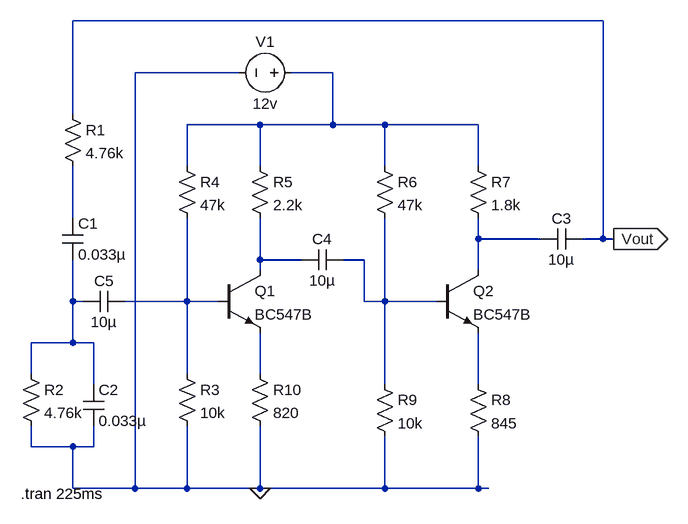
[diagram p0: schematic weinBridge.asc]
weinBridge.asc, the LTspice schematic file:
Version 4
SHEET 1 880 680
WIRE 672 -160 -144 -160
WIRE 112 -80 -48 -80
WIRE 256 -80 192 -80
WIRE -144 -16 -144 -160
WIRE 144 0 32 0
WIRE 256 0 256 -80
WIRE 256 0 144 0
WIRE 336 0 256 0
WIRE 480 0 336 0
WIRE 32 64 32 0
WIRE 144 64 144 0
WIRE 336 64 336 0
WIRE 480 64 480 0
WIRE -144 144 -144 64
WIRE 480 176 480 144
WIRE 576 176 480 176
WIRE 672 176 672 -160
WIRE 672 176 640 176
WIRE 688 176 672 176
WIRE 144 208 144 144
WIRE 208 208 144 208
WIRE 304 208 272 208
WIRE 144 224 144 208
WIRE 480 224 480 176
WIRE -144 272 -144 208
WIRE -128 272 -144 272
WIRE 32 272 32 144
WIRE 32 272 -64 272
WIRE 80 272 32 272
WIRE 304 272 304 208
WIRE 336 272 336 144
WIRE 336 272 304 272
WIRE 416 272 336 272
WIRE -144 336 -144 272
WIRE -144 336 -208 336
WIRE -112 336 -144 336
WIRE -208 384 -208 336
WIRE 32 384 32 272
WIRE 144 384 144 320
WIRE -112 400 -112 336
WIRE 336 400 336 272
WIRE 480 400 480 320
WIRE -208 496 -208 464
WIRE -144 496 -208 496
WIRE -112 496 -112 464
WIRE -112 496 -144 496
WIRE -144 560 -144 496
WIRE -48 560 -48 -80
WIRE -48 560 -144 560
WIRE 32 560 32 464
WIRE 32 560 -48 560
WIRE 144 560 144 464
WIRE 144 560 32 560
WIRE 336 560 336 480
WIRE 336 560 144 560
WIRE 480 560 480 480
WIRE 480 560 336 560
WIRE 496 560 480 560
FLAG 144 560 0
FLAG 688 176 Vout
IOPIN 688 176 Out
SYMBOL res -160 -32 R0
SYMATTR InstName R1
SYMATTR Value 4.76k
SYMBOL cap -160 144 R0
SYMATTR InstName C1
SYMATTR Value 0.033µ
SYMBOL cap -128 400 R0
SYMATTR InstName C2
SYMATTR Value 0.033µ
SYMBOL res -224 368 R0
SYMATTR InstName R2
SYMATTR Value 4.76k
SYMBOL res 16 368 R0
SYMATTR InstName R3
SYMATTR Value 10k
SYMBOL res 16 48 R0
SYMATTR InstName R4
SYMATTR Value 47k
SYMBOL res 128 48 R0
SYMATTR InstName R5
SYMATTR Value 2.2k
SYMBOL res 320 48 R0
SYMATTR InstName R6
SYMATTR Value 47k
SYMBOL res 464 48 R0
SYMATTR InstName R7
SYMATTR Value 1.8k
SYMBOL res 464 384 R0
SYMATTR InstName R8
SYMATTR Value 845
SYMBOL res 320 384 R0
SYMATTR InstName R9
SYMATTR Value 10k
SYMBOL res 128 368 R0
SYMATTR InstName R10
SYMATTR Value 820
SYMBOL npn 80 224 R0
SYMATTR InstName Q1
SYMATTR Value BC547B
SYMBOL npn 416 224 R0
SYMATTR InstName Q2
SYMATTR Value BC547B
SYMBOL cap 640 160 R90
WINDOW 0 0 32 VBottom 2
WINDOW 3 32 32 VTop 2
SYMATTR InstName C3
SYMATTR Value 10µ
SYMBOL cap 272 192 R90
WINDOW 0 0 32 VBottom 2
WINDOW 3 32 32 VTop 2
SYMATTR InstName C4
SYMATTR Value 10µ
SYMBOL voltage 208 -80 R90
WINDOW 0 -32 56 VBottom 2
WINDOW 3 32 56 VTop 2
SYMATTR InstName V1
SYMATTR Value 12v
SYMBOL cap -64 256 R90
WINDOW 0 0 32 VBottom 2
WINDOW 3 32 32 VTop 2
SYMATTR InstName C5
SYMATTR Value 10µ
TEXT -224 568 Left 2 !.tran 225ms

The netlist it stands for:
* weinBridge.asc
R1 Vout N002 4.76k
C1 N002 N006 0.033µ
C2 N006 0 0.033µ
R2 N006 0 4.76k
R3 N007 0 10k
R4 N001 N007 47k
R5 N001 N004 2.2k
R6 N001 N005 47k
R7 N001 N003 1.8k
R8 N009 0 845
R9 N005 0 10k
R10 N008 0 820
Q1 N004 N007 N008 0 BC547B
Q2 N003 N005 N009 0 BC547B
C3 Vout N003 10µ
C4 N005 N004 10µ
V1 N001 0 12v
C5 N007 N006 10µ
.model NPN NPN
.model PNP PNP
.lib standard.bjt
.tran 225ms
.backanno
.end